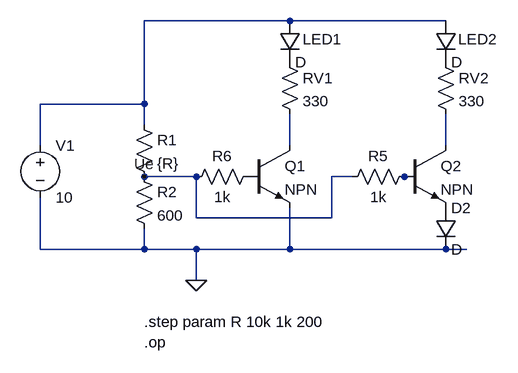
[diagram p0: schematic NTC.asc]
NTC.asc, the LTspice schematic file:
Version 4
SHEET 1 880 680
WIRE 320 -112 96 -112
WIRE 560 -112 320 -112
WIRE 96 16 96 -112
WIRE 96 16 -64 16
WIRE 96 48 96 16
WIRE -64 80 -64 16
WIRE 320 80 320 32
WIRE 560 80 560 32
WIRE 176 128 96 128
WIRE 416 128 384 128
WIRE 512 128 496 128
WIRE 176 192 176 128
WIRE 384 192 384 128
WIRE 384 192 176 192
WIRE -64 240 -64 160
WIRE 96 240 96 208
WIRE 96 240 -64 240
WIRE 176 240 96 240
WIRE 320 240 320 176
WIRE 320 240 176 240
WIRE 560 240 320 240
WIRE 592 240 560 240
WIRE 176 288 176 240
FLAG 176 288 0
FLAG 96 128 Ue
SYMBOL res 80 32 R0
SYMATTR InstName R1
SYMATTR Value {R}
SYMBOL res 80 112 R0
SYMATTR InstName R2
SYMATTR Value 600
SYMBOL npn 256 80 R0
SYMATTR InstName Q1
SYMBOL voltage -64 64 R0
WINDOW 123 0 0 Left 2
WINDOW 39 0 0 Left 2
SYMATTR InstName V1
SYMATTR Value 10
SYMBOL res 304 -64 R0
SYMATTR InstName RV1
SYMATTR Value 330
SYMBOL diode 304 -112 R0
WINDOW 0 36 28 Left 2
SYMATTR InstName LED1
SYMBOL npn 496 80 R0
SYMATTR InstName Q2
SYMBOL res 544 -64 R0
SYMATTR InstName RV2
SYMATTR Value 330
SYMBOL diode 544 -112 R0
WINDOW 0 35 28 Left 2
SYMATTR InstName LED2
SYMBOL diode 544 176 R0
SYMATTR InstName D2
SYMBOL res 512 112 R90
WINDOW 0 0 56 VBottom 2
WINDOW 3 32 56 VTop 2
SYMATTR InstName R5
SYMATTR Value 1k
SYMBOL res 272 112 R90
WINDOW 0 0 56 VBottom 2
WINDOW 3 32 56 VTop 2
SYMATTR InstName R6
SYMATTR Value 1k
TEXT 96 352 Left 2 !.step param R 10k 1k 200\n.op

The netlist it stands for:
* NTC.asc
R1 N001 Ue {R}
R2 Ue 0 600
Q1 N002 P001 0 0 NPN
V1 N001 0 10
RV1 P002 N002 330
D§LED1 N001 P002 D
Q2 N003 N004 P003 0 NPN
RV2 P004 N003 330
D§LED2 N001 P004 D
D2 P003 0 D
R5 N004 Ue 1k
R6 P001 Ue 1k
.model D D
.lib standard.dio
.model NPN NPN
.model PNP PNP
.lib standard.bjt
.step param R 10k 1k 200
.op
.backanno
.end

* Results of the author's LTspice run, read from the files saved beside the schematic
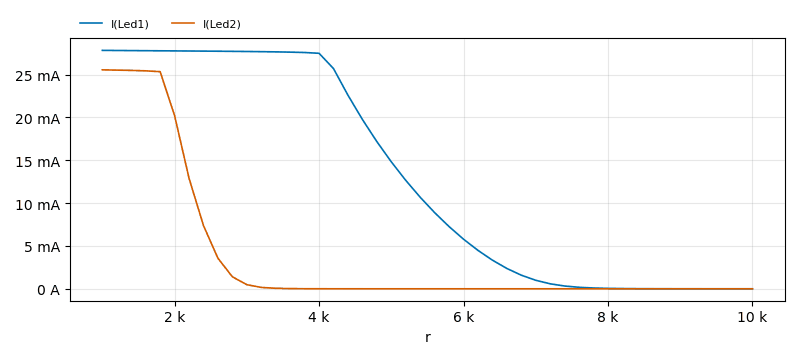
[diagram p1: Operating Point of NTC.asc, plotted from the saved traces]
* Operating Point, 1 run:
*   I(Led1): 319.3 nA at r=10 k, 27.82 mA at r=1 k, min 319.3 nA, max 27.82 mA
*   I(Led2): 65.37 pA at r=10 k, 25.55 mA at r=1 k, min 65.37 pA, max 25.55 mA
* From the log:
*   Semiconductor Device Operating Points:
*                           --- Diodes ---
*   Name:      d2        d§led2      d§led1
*   Model:      d           d           d
*   Id:      5.71e-11    6.54e-11    3.19e-07
*   Vd:      2.24e-01    2.27e-01    4.47e-01
*   Req:     4.55e+08    3.97e+08    8.10e+04
*   CAP:     0.00e+00    0.00e+00    0.00e+00
*                           --- Bipolar Transistors ---
*   Name:       q2          q1
*   Model:      npn         npn
*   Ib:      -8.30e-12    3.18e-09
*   Ic:       6.54e-11    3.19e-07
*   Vbe:      3.42e-01    5.66e-01
*   Vbc:     -9.21e+00   -8.99e+00
*   Vce:      9.55e+00    9.55e+00
*   BetaDC:  -7.87e+00    1.00e+02
*   Gm:       2.17e-09    1.23e-05
*   Rpi:      4.40e+10    8.10e+06
*   Rx:       0.00e+00    0.00e+00
*   Ro:         NaN         NaN
*   Cbe:      0.00e+00    0.00e+00
*   Cbc:      0.00e+00    0.00e+00
*   Cjs:      0.00e+00    0.00e+00
*   BetaAC:   9.56e+01    1.00e+02
*   Cbx:      0.00e+00    0.00e+00
*   Ft:       0.00e+00    0.00e+00